# Altium project RFC_MB.PrjPcb (part 5 of 7)

## Sheet DCP_DC_DC.SchDoc
size 209 x 297 mm; Address1: Address1; Address2: Address2; Address3: Address3; Address4: Address4; SheetNumber: 1; Scale: 1:1; Разраб.: Иванов; Обозначение документа: АБВГ.123456.001 Э3; Пров.: Петров; Утв.: Сидоров; Наименование организации: ОАО "Концерн "МПО-Гидроприбор"; Перв. применение: АБВГ.123456.000; Наименование изделия 1: Плата; Наименование изделия 2: Схема электрическая; Наименование изделия 3: принципиальная; Нач. отд.: Нач. отд.; Фамилия нач. отд.: Сидоров
Used 7 times, as channels RF/RF_H/H_DCDC/DCP_H-, RF/RF_i/i_DCDC/DCP_i-, RF/RF_i/i_DCDC/DCP_i+, RF/RF_D/D_DCDC/DCP_D+, RF/RF_D/D_DCDC/DCP_D-, RF/RF_S/S_DCDC/DCP_S+, RF/RF_S/S_DCDC/DCP_S-. Parts and nets are listed once, with the designators drawn on the sheet.
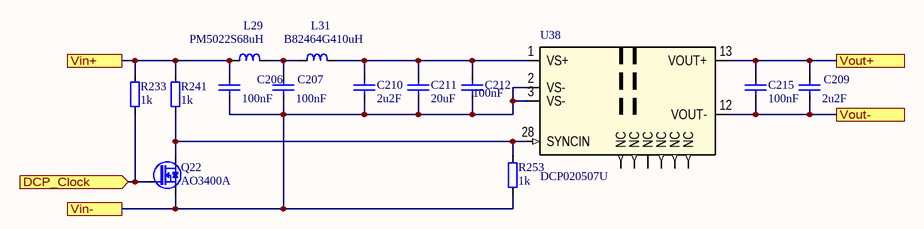
[diagram p15: DCP_DC_DC.SchDoc]

### Parts
C206  100nF  [SMD0805CAP]
C207  100nF  [SMD0805CAP]
C209  2u2F  [SMD0805CAP]
C210  2u2F  [SMD0805CAP]
C211  20uF  [CAPC1206]
C212  100nF  [SMD0805CAP]
C215  100nF  [SMD0805CAP]
L29  PM5022S68uH  [IND_Bourns_PM5022S]
L31  B82464G410uH  [IND_COILCRAFT_MSS1038]
Q22  AO3400A  [SOT95P229X119-3N]
R233  1k  [SMD0805RES]
R241  1k  [SMD0805RES]
R253  1k  [SMD0805RES]
U38  DCP020507U  [SOIC127P1033X265-12_28N]

### Ports
DCP_Clock (in), Vin+, Vin-, Vout+, Vout-

### Nets
DCP_Clock: Q22.1(G) R233.2 ; port DCP_Clock
Vin+: C206.2 L29.1 R233.1 R241.1 ; port Vin+
Vin-: C206.1 C207.1 C210.1 C211.1 C212.1 Q22.2(S) R253.2 U38.2(VS-) U38.3(VS-) ; port Vin-
Vout+: C209.2 C215.2 U38.13(VOUT+) ; port Vout+
Vout-: C209.1 C215.1 U38.12(VOUT-) ; port Vout-
NetC207_2: C207.2 L29.2 L31.1
NetC210_2: C210.2 C211.2 C212.2 L31.2 U38.1(VS+)
NetQ22_3: Q22.3(D) R241.2 R253.1 U38.28(SYNCIN)

Not connected (* = marked no-connect by the designer): U38 14(NC) 15(NC) 16(NC) 17(NC) 26(NC) 27(NC)

### Channels
RF/RF_H/H_DCDC/DCP_H-: designators end in _1; ports DCP_Clock=Clock_hDCP- Vin+=+5V Vin-=GND Vout+=GND Vout-=-7H
RF/RF_i/i_DCDC/DCP_i-: designators end in _2; ports DCP_Clock=Clock_iDCP- Vin+=+5V Vin-=GND Vout+=intG Vout-=-7i
RF/RF_i/i_DCDC/DCP_i+: designators end in _3; ports DCP_Clock=Clock_iDCP+ Vin+=+5V Vin-=GND Vout+=intG Vout-=+7H
RF/RF_D/D_DCDC/DCP_D+: designators end in _4; ports DCP_Clock=NetQ22_4_1 Vin+=+5V Vin-=GND Vout+=+7D Vout-=GND
RF/RF_D/D_DCDC/DCP_D-: designators end in _5; ports DCP_Clock=NetQ22_4_1 Vin+=+5V Vin-=GND Vout+=GND Vout-=-7D
RF/RF_S/S_DCDC/DCP_S+: designators end in _6; ports DCP_Clock=NetQ22_6_1 Vin+=+5V Vin-=GND Vout+=+7_ Vout-=GND
RF/RF_S/S_DCDC/DCP_S-: designators end in _7; ports DCP_Clock=NetQ22_6_1 Vin+=+5V Vin-=GND Vout+=GND Vout-=-7_

### Notes on the sheet
- Перв. примен.
- Справ. №
- Подп. и дата
- Инв. № дубл.
- Взам. инв. №
- Инв. № подл.
- Изм.
- Лист
- № докум.
- Подп.
- Дата
- Копировал
- Формат А4

### Library data of the parts
C206 C207 C209 C210 C212 C215 = C0805: Чип конденсатор 0805; Voltage: 25V; Vendor: Vishay; DielectricType: X5R; SMD Solders: 2; Solder Option: RM; Tolerance: 20%; Pkg: SMD0805; Device: Cap0805; Price: 2
  C206 C207 C212 C215: Value: 100nF
  C209 C210: Value: 2u2F
C211 = C1206: Чип конденсатор 0805; Voltage: 16V; Vendor: Vishay; DielectricType: X5R; SMD Solders: 2; Solder Option: RM; Tolerance: 1%; Pkg: SMD1206; Device: Cap1206; Value: 20uF; Price: 2
L29 = IND_BOURNS_PM5022S: SMD Дроссель; Vendor: Panasonic; Value: 68uH; Voltage: 2; Solder Option: RM; Tolerance: 20%; Pkg: SMD13x13mm; THD Solders: 0; Name to order: PM5022s-680M-RM; Current: 1A6; Price: 400; SMD Solders: 2; Device: PM5022S
L31 = B82464G4: SMD Дроссель; Vendor: Epcos; Value: 10uH; Voltage: 2; Solder Option: RM; Tolerance: 20%; Pkg: SMD10.4x10.4mm; THD Solders: 0; Name to order: B82464G4103M; Current: 3A5; Price: 400; SMD Solders: 2; Device: B82464G4
Q22 = AO3400A: NMOS; Vendor: UMW; Pkg: SOT23; SMD Solders: 3; Solder Option: RM; Voltage: 30V; Price: 10; Device: AO3400A; Name to order: AO3400A
R233 R241 R253 = R0805: Чип резистор 0805; Vendor: Vishay; SMD Solders: 2; Solder Option: RM; TC: 100ppm/C; Tolerance: 1%; Pkg: SMD0805; Pwr: 125mW; Device: Res0805; Price: 2; Value: 1k
U38 = DCP02xxyyU: DC/DC xxV to isolated  yyV; Vendor: Texas Instruments; Value: 0507U; Device: DCP02; Pkg: SOIC28; SMD Solders: 6; Solder Option: RM; Voltage: 7V; Copyright: Copyright (C) 2022 Ultra Librarian. All rights reserved.; Price: 1000

## Sheet Integrator.SchDoc
size 594 x 420 mm; Address1: Address1; Address2: Address2; Address3: Address3; Address4: Address4; SheetNumber: 1; Scale: 1:1; Разраб.: Иванов; Обозначение документа: АБВГ.123456.001 Э3; Пров.: Петров; Утв.: Сидоров; Наименование организации: ОАО "Концерн "МПО-Гидроприбор"; Перв. применение: АБВГ.123456.000; Наименование изделия 1: Плата; Наименование изделия 2: Схема электрическая; Наименование изделия 3: принципиальная; Нач. отд.: Нач. отд.; Фамилия нач. отд.: Сидоров
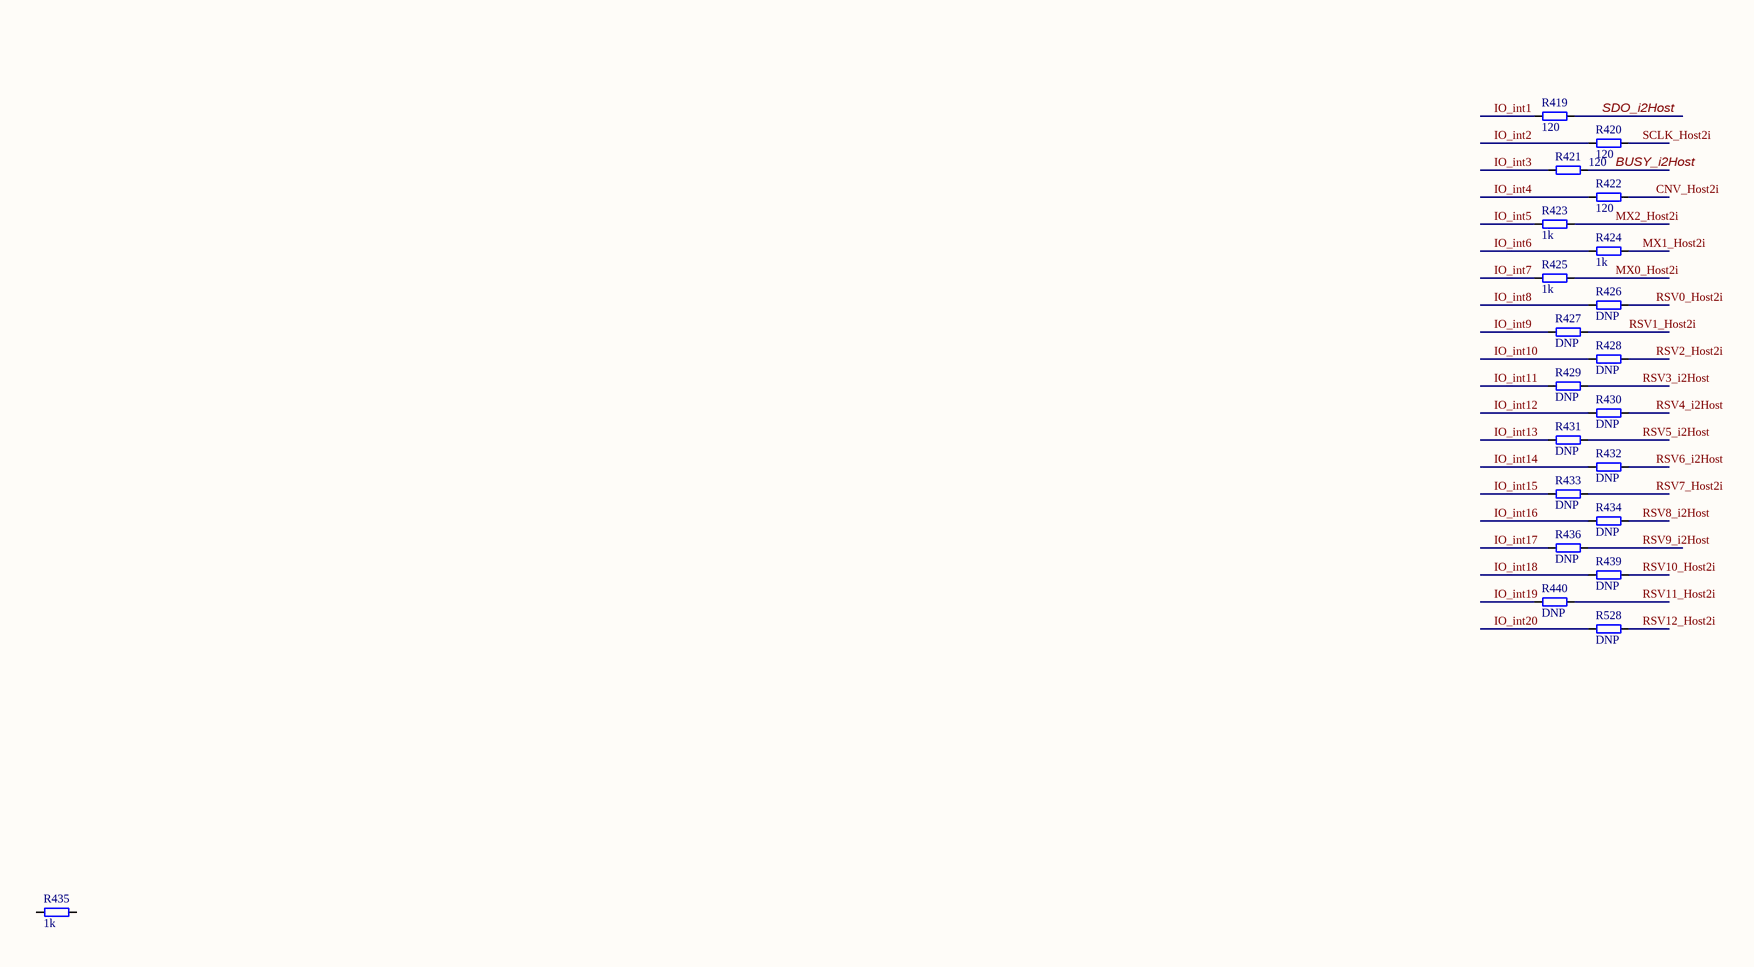
[diagram p16: Integrator.SchDoc, left]
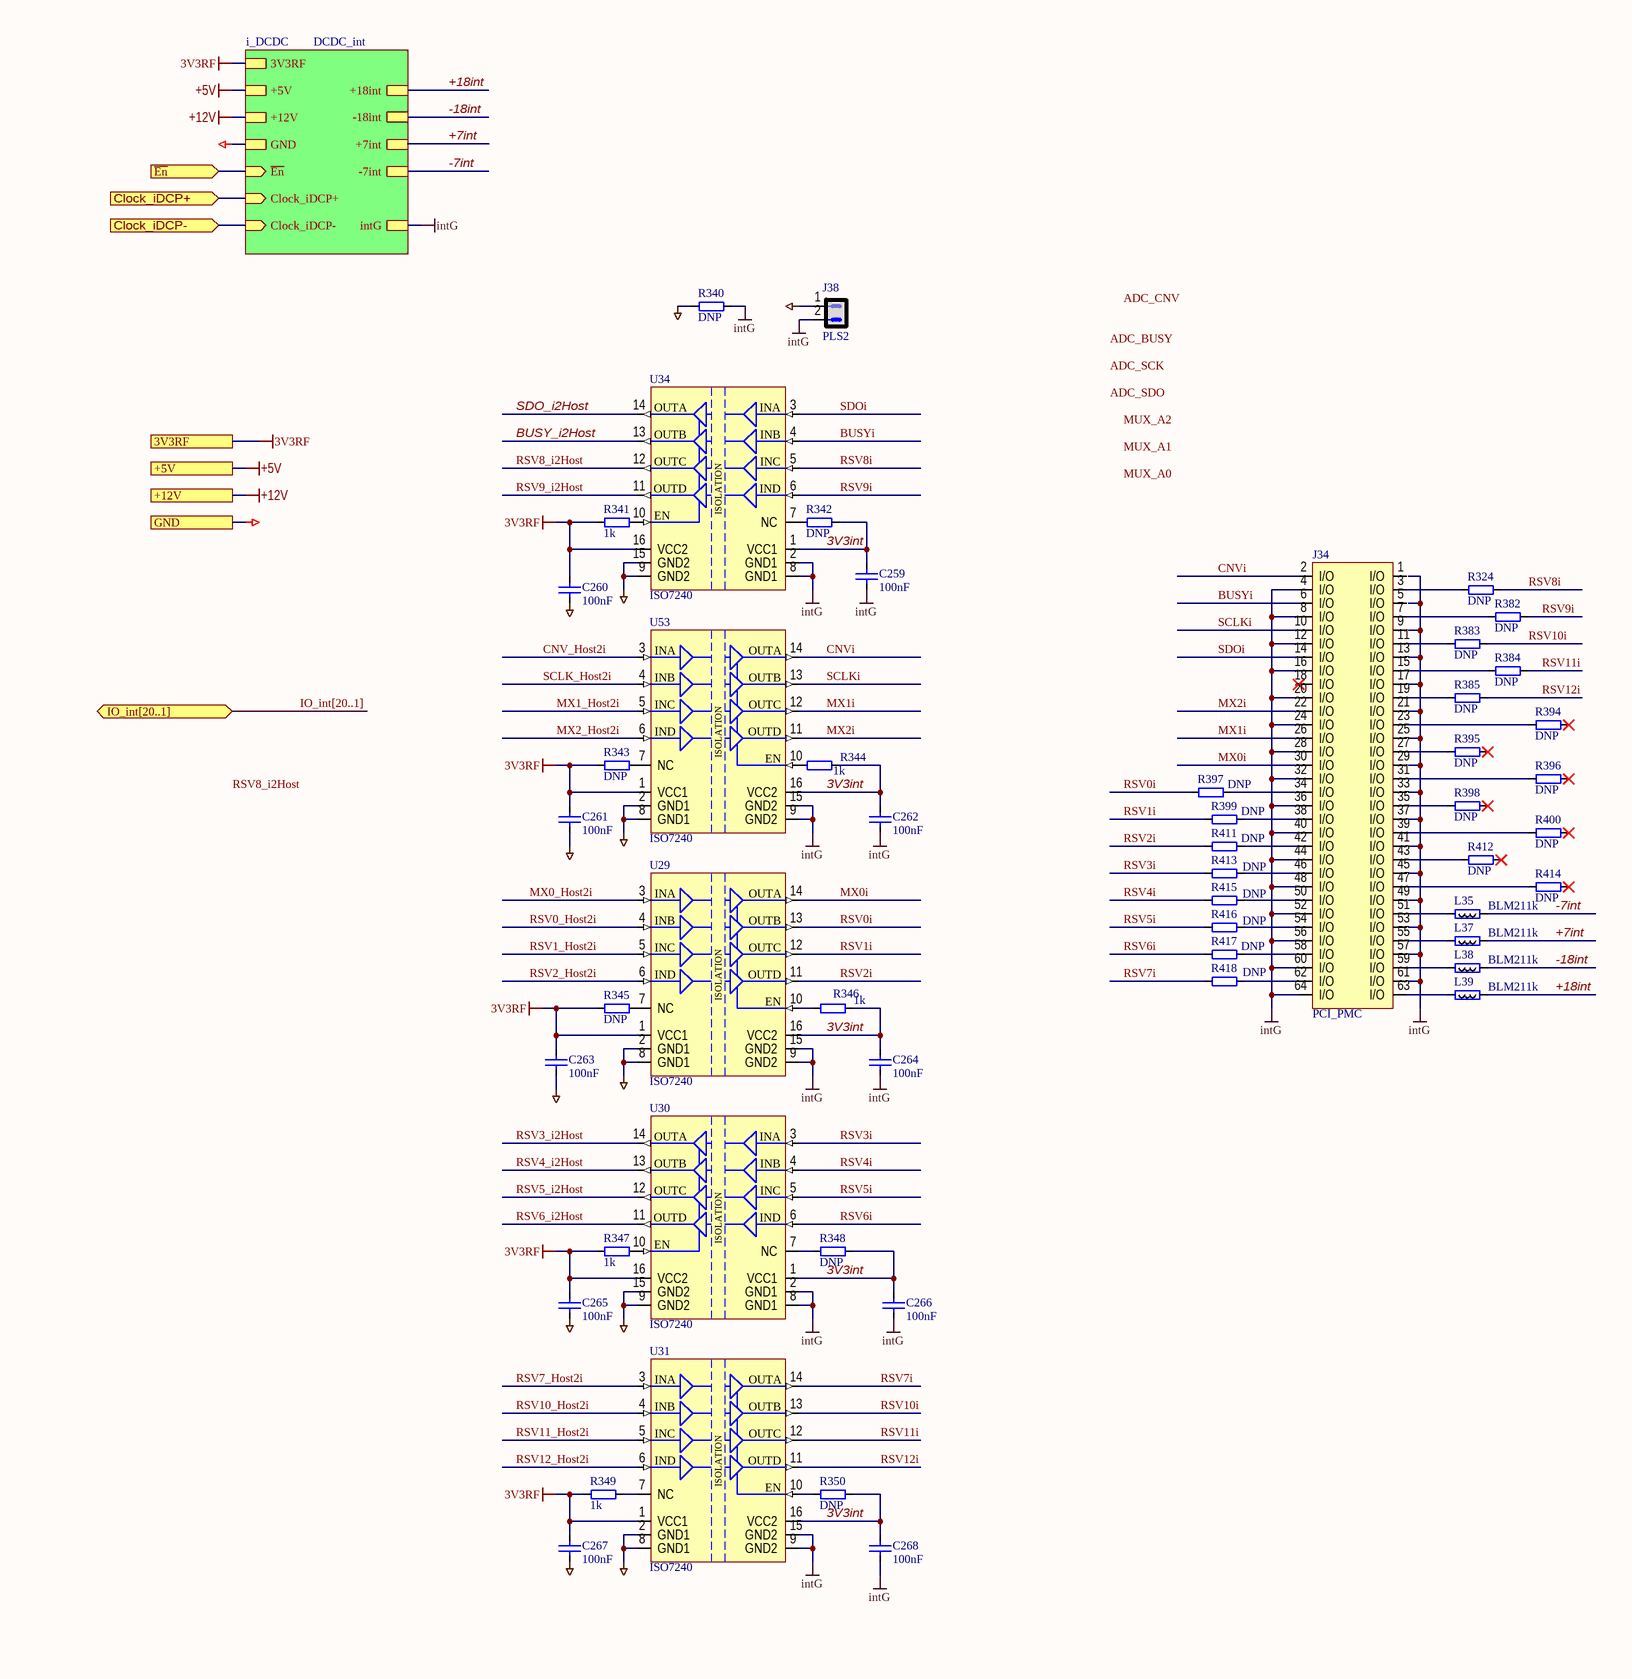
[diagram p17: Integrator.SchDoc, right]

### Parts
C259  100nF  [SMD0805CAP]
C260  100nF  [SMD0805CAP]
C261  100nF  [SMD0805CAP]
C262  100nF  [SMD0805CAP]
C263  100nF  [SMD0805CAP]
C264  100nF  [SMD0805CAP]
C265  100nF  [SMD0805CAP]
C266  100nF  [SMD0805CAP]
C267  100nF  [SMD0805CAP]
C268  100nF  [SMD0805CAP]
J34  PCI_PMC  [TYCO_120521-1]
J38  PLS2  [PLS2]
L35  BLM211k  [RESC2012X50N]
L37  BLM211k  [RESC2012X50N]
L38  BLM211k  [RESC2012X50N]
L39  BLM211k  [RESC2012X50N]
R324  DNP  [SMD0805RES]
R340  DNP  [SMD0805RES]
R341  1k  [SMD0805RES]
R342  DNP  [SMD0805RES]
R343  DNP  [SMD0805RES]
R344  1k  [SMD0805RES]
R345  DNP  [SMD0805RES]
R346  1k  [SMD0805RES]
R347  1k  [SMD0805RES]
R348  DNP  [SMD0805RES]
R349  1k  [SMD0805RES]
R350  DNP  [SMD0805RES]
R382  DNP  [SMD0805RES]
R383  DNP  [SMD0805RES]
R384  DNP  [SMD0805RES]
R385  DNP  [SMD0805RES]
R394  DNP  [SMD0805RES]
R395  DNP  [SMD0805RES]
R396  DNP  [SMD0805RES]
R397  DNP  [SMD0805RES]
R398  DNP  [SMD0805RES]
R399  DNP  [SMD0805RES]
R400  DNP  [SMD0805RES]
R411  DNP  [SMD0805RES]
R412  DNP  [SMD0805RES]
R413  DNP  [SMD0805RES]
R414  DNP  [SMD0805RES]
R415  DNP  [SMD0805RES]
R416  DNP  [SMD0805RES]
R417  DNP  [SMD0805RES]
R418  DNP  [SMD0805RES]
R419  120  [SMD0805RES]
R420  120  [SMD0805RES]
R421  120  [SMD0805RES]
R422  120  [SMD0805RES]
R423  1k  [SMD0805RES]
R424  1k  [SMD0805RES]
R425  1k  [SMD0805RES]
R426  DNP  [SMD0805RES]
R427  DNP  [SMD0805RES]
R428  DNP  [SMD0805RES]
R429  DNP  [SMD0805RES]
R430  DNP  [SMD0805RES]
R431  DNP  [SMD0805RES]
R432  DNP  [SMD0805RES]
R433  DNP  [SMD0805RES]
R434  DNP  [SMD0805RES]
R435  1k  [SMD0805RES]
R436  DNP  [SMD0805RES]
R439  DNP  [SMD0805RES]
R440  DNP  [SMD0805RES]
R528  DNP  [SMD0805RES]
U29  ISO7240  [SOIC127P1030X265-16N]
U30  ISO7240  [SOIC127P1030X265-16N]
U31  ISO7240  [SOIC127P1030X265-16N]
U34  ISO7240  [SOIC127P1030X265-16N]
U53  ISO7240  [SOIC127P1030X265-16N]

### Sub-sheets
i_DCDC = DCDC_int: +18int, -18int, -7int, +7int, ~{En} (in), Clock_iDCP- (in), Clock_iDCP+ (in), +5V, +12V, GND, 3V3RF, intG

### Ports
3V3RF, +5V, +12V, Clock_iDCP+ (in), Clock_iDCP- (in), GND, IO_int[20..1] (bidir), ~{En} (in)

### Nets
3V3RF: C260.2 C261.2 C263.2 C265.2 C267.2 R341.1 R343.1 R345.1 R347.1 R349.1 U29.1(VCC1) U30.16(VCC2) U31.1(VCC1) U34.16(VCC2) U53.1(VCC1) ; port 3V3RF, sheet i_DCDC/3V3RF
+5V: port +5V, sheet i_DCDC/+5V
+12V: port +12V, sheet i_DCDC/+12V
GND: C260.1 C261.1 C263.1 C265.1 C267.1 J38.1 R340.1 U29.2(GND1) U29.8(GND1) U30.9(GND2) U30.15(GND2) U31.2(GND1) U31.8(GND1) U34.9(GND2) U34.15(GND2) U53.2(GND1) U53.8(GND1) ; port GND, sheet i_DCDC/GND
intG: C259.1 C262.1 C264.1 C266.1 C268.1 J34.4(I/O) J34.8(I/O) J34.12(I/O) J34.16(I/O) J34.20(I/O) J34.24(I/O) J34.28(I/O) J34.32(I/O) J34.36(I/O) J34.40(I/O) J34.44(I/O) J34.48(I/O) J34.52(I/O) J34.56(I/O) J34.60(I/O) J34.64(I/O) J38.2 R340.2 U29.9(GND2) U29.15(GND2) U30.2(GND1) U30.8(GND1) U31.9(GND2) U31.15(GND2) U34.2(GND1) U34.8(GND1) U53.9(GND2) U53.15(GND2) ; sheet i_DCDC/intG
3V3int: C259.2 C262.2 C264.2 C266.2 C268.2 R342.2 R344.2 R346.2 R348.2 R350.2 U29.16(VCC2) U30.1(VCC1) U31.16(VCC2) U34.1(VCC1) U53.16(VCC2)
+7int: L37.2 ; sheet i_DCDC/+7int
+18int: L39.2 ; sheet i_DCDC/+18int
-7int: L35.2 ; sheet i_DCDC/-7int
-18int: L38.2 ; sheet i_DCDC/-18int
~{En}: port ~{En}, sheet i_DCDC/~{En}
BUSY_i2Host: R421.2 U34.13(OUTB)
BUSYi: J34.6(I/O) U34.4(INB)
Clock_iDCP+: port Clock_iDCP+, sheet i_DCDC/Clock_iDCP+
Clock_iDCP-: port Clock_iDCP-, sheet i_DCDC/Clock_iDCP-
CNV_Host2i: R422.2 U53.3(INA)
CNVi: J34.2(I/O) U53.14(OUTA)
IO_int1: R419.1  [project net IO_BL17]
IO_int2: R420.1  [project net IO_BL18]
IO_int3: R421.1  [project net IO_BL19]
IO_int4: R422.1  [project net IO_BL20]
IO_int5: R423.1  [project net IO_BL21]
IO_int6: R424.1  [project net IO_BL22]
IO_int7: R425.1  [project net IO_BL23]
IO_int8: R426.1  [project net IO_BL24]
IO_int9: R427.1  [project net IO_BL25]
IO_int10: R428.1  [project net IO_BL26]
IO_int11: R429.1  [project net IO_BL27]
IO_int12: R430.1  [project net IO_BL28]
IO_int13: R431.1  [project net IO_BL29]
IO_int14: R432.1  [project net IO_BL30]
IO_int15: R433.1  [project net IO_BL31]
IO_int16: R434.1  [project net IO_BL32]
IO_int17: R436.1  [project net IO_BL33]
IO_int18: R439.1  [project net IO_BL34]
IO_int19: R440.1  [project net IO_BL35]
IO_int20: R528.1  [project net IO_BL36]
MX0_Host2i: R425.2 U29.3(INA)
MX0i: J34.30(I/O) U29.14(OUTA)
MX1_Host2i: R424.2 U53.5(INC)
MX1i: J34.26(I/O) U53.12(OUTC)
MX2_Host2i: R423.2 U53.6(IND)
MX2i: J34.22(I/O) U53.11(OUTD)
RSV0_Host2i: R426.2 U29.4(INB)
RSV0i: R397.1 U29.13(OUTB)
RSV1_Host2i: R427.2 U29.5(INC)
RSV1i: R399.1 U29.12(OUTC)
RSV2_Host2i: R428.2 U29.6(IND)
RSV2i: R411.1 U29.11(OUTD)
RSV3_i2Host: R429.2 U30.14(OUTA)
RSV3i: R413.1 U30.3(INA)
RSV4_i2Host: R430.2 U30.13(OUTB)
RSV4i: R415.1 U30.4(INB)
RSV5_i2Host: R431.2 U30.12(OUTC)
RSV5i: R416.1 U30.5(INC)
RSV6_i2Host: R432.2 U30.11(OUTD)
RSV6i: R417.1 U30.6(IND)
RSV7_Host2i: R433.2 U31.3(INA)
RSV7i: R418.1 U31.14(OUTA)
RSV8_i2Host: R434.2 U34.12(OUTC)
RSV8i: R324.2 U34.5(INC)
RSV9_i2Host: R436.2 U34.11(OUTD)
RSV9i: R382.2 U34.6(IND)
RSV10_Host2i: R439.2 U31.4(INB)
RSV10i: R383.2 U31.13(OUTB)
RSV11_Host2i: R440.2 U31.5(INC)
RSV11i: R384.2 U31.12(OUTC)
RSV12_Host2i: R528.2 U31.6(IND)
RSV12i: R385.2 U31.11(OUTD)
SCLK_Host2i: R420.2 U53.4(INB)
SCLKi: J34.10(I/O) U53.13(OUTB)
SDO_i2Host: R419.2 U34.14(OUTA)
SDOi: J34.14(I/O) U34.3(INA)
NetJ34_3: J34.3(I/O) R324.1
NetJ34_7: J34.7(I/O) R382.1
NetJ34_11: J34.11(I/O) R383.1
NetJ34_15: J34.15(I/O) R384.1
NetJ34_19: J34.19(I/O) R385.1
NetJ34_23: J34.23(I/O) R394.1
NetJ34_27: J34.27(I/O) R395.1
NetJ34_31: J34.31(I/O) R396.1
NetJ34_34: J34.34(I/O) R397.2
NetJ34_35: J34.35(I/O) R398.1
NetJ34_38: J34.38(I/O) R399.2
NetJ34_39: J34.39(I/O) R400.1
NetJ34_42: J34.42(I/O) R411.2
NetJ34_43: J34.43(I/O) R412.1
NetJ34_46: J34.46(I/O) R413.2
NetJ34_47: J34.47(I/O) R414.1
NetJ34_50: J34.50(I/O) R415.2
NetJ34_51: J34.51(I/O) L35.1
NetJ34_54: J34.54(I/O) R416.2
NetJ34_55: J34.55(I/O) L37.1
NetJ34_58: J34.58(I/O) R417.2
NetJ34_59: J34.59(I/O) L38.1
NetJ34_62: J34.62(I/O) R418.2
NetJ34_63: J34.63(I/O) L39.1
NetR341_2: R341.2 U34.10(EN)
NetR342_1: R342.1 U34.7(NC)
NetR343_2: R343.2 U53.7(NC)
NetR344_1: R344.1 U53.10(EN)
NetR345_2: R345.2 U29.7(NC)
NetR346_1: R346.1 U29.10(EN)
NetR347_2: R347.2 U30.10(EN)
NetR348_1: R348.1 U30.7(NC)
NetR349_2: R349.2 U31.7(NC)
NetR350_1: R350.1 U31.10(EN)

Not connected (* = marked no-connect by the designer): J34 1(I/O) 5(I/O) 9(I/O) 13(I/O) 17(I/O) 18(I/O)* 21(I/O) 25(I/O) 29(I/O) 33(I/O) 37(I/O) 41(I/O) 45(I/O) 49(I/O) 53(I/O) 57(I/O) 61(I/O); R394 2*; R395 2*; R396 2*; R398 2*; R400 2*; R412 2*; R414 2*; R435 1 2

### Buses and harness runs
bus IO_int[20..1] = port IO_int[20..1]

### Notes on the sheet
- Labels drawn without touching a wire or pin: ADC_BUSY, ADC_CNV, ADC_SCK, ADC_SDO, MUX_A0, MUX_A1, MUX_A2, RSV8_i2Host
- Подп. и дата
- Инв. № дубл.
- Взам. инв. №
- Инв. № подл.
- Изм.
- Лист
- № докум.
- Подп.
- Дата
- Копировал
- Формат А2
- (in symbol ISO7240M) ISOLATION

### Library data of the parts
C259-C268 = C0805: as C206 on sheet DCP_DC_DC; Value: 100nF; Price: 2
J34 = PCI_PMC_M: PCI Mezzanine Connector; IEEE 1386 MainBoard; Manufactuer: TE Connectivity; PartField: 120527-1; SolderOption: 2; Pkg: PMC Male (IEEE 1386); Value: PCI_PMC; Vendor: TE Connectivity
J38 = PLS2: Vendor: Confly; SMD Solders: 0; Solder Option: RM; THD Solders: 2; Price: 1; Device: PLS2
L35 L37-L39 = BLM21: SMD Ferrite bead 0805; Vendor: Vishay; Value: 1k; Pkg: SMD0805; SMD Solders: 2; Solder Option: RM; Price: 10; Device: BLM21
R324 R341 R344 R346 R347 R349 R382-R385 R394-R400 R411-R436 R439 R440 R528 = R0805: as R233 on sheet DCP_DC_DC; Price: 2
  R324 R382-R385 R394-R400 R411-R418 R426-R434 R436 R439 R440 R528: Value: DNP
  R341 R344 R346 R347 R349 R423-R425 R435: Value: 1k
  R419-R422: Value: 120
R340 R342 R343 R345 R348 R350 = R0805: Чип резистор 0805; Vendor: Vishay; SMD Solders: 2; Solder Option: i; TC: 100ppm/C; Tolerance: 1%; Pkg: SMD0805; Pwr: 125mW; Device: Res0805; Price: 2; Value: DNP
U29-U31 U34 U53 = ISO7240M: Двунаправленный буфер; Pkg: SOIC16DW; SMD Solders: 16; Solder Option: RM; THD Solders: 0; Vendor: Texas Instruments; Voltage: 3V3 or 5V; Name to order: ISO7240MDWR; Current: 30; Device: ISO7240; Price: 3500

## Sheet DCDC_int.SchDoc
size 420 x 297 mm; Address1: Address1; Address2: Address2; Address3: Address3; Address4: Address4; SheetNumber: 1; Scale: 1:1; Разраб.: Иванов; Обозначение документа: АБВГ.123456.001 Э3; Пров.: Петров; Утв.: Сидоров; Наименование организации: ОАО "Концерн "МПО-Гидроприбор"; Перв. применение: АБВГ.123456.000; Наименование изделия 1: Плата; Наименование изделия 2: Схема электрическая; Наименование изделия 3: принципиальная; Нач. отд.: Нач. отд.; Фамилия нач. отд.: Сидоров
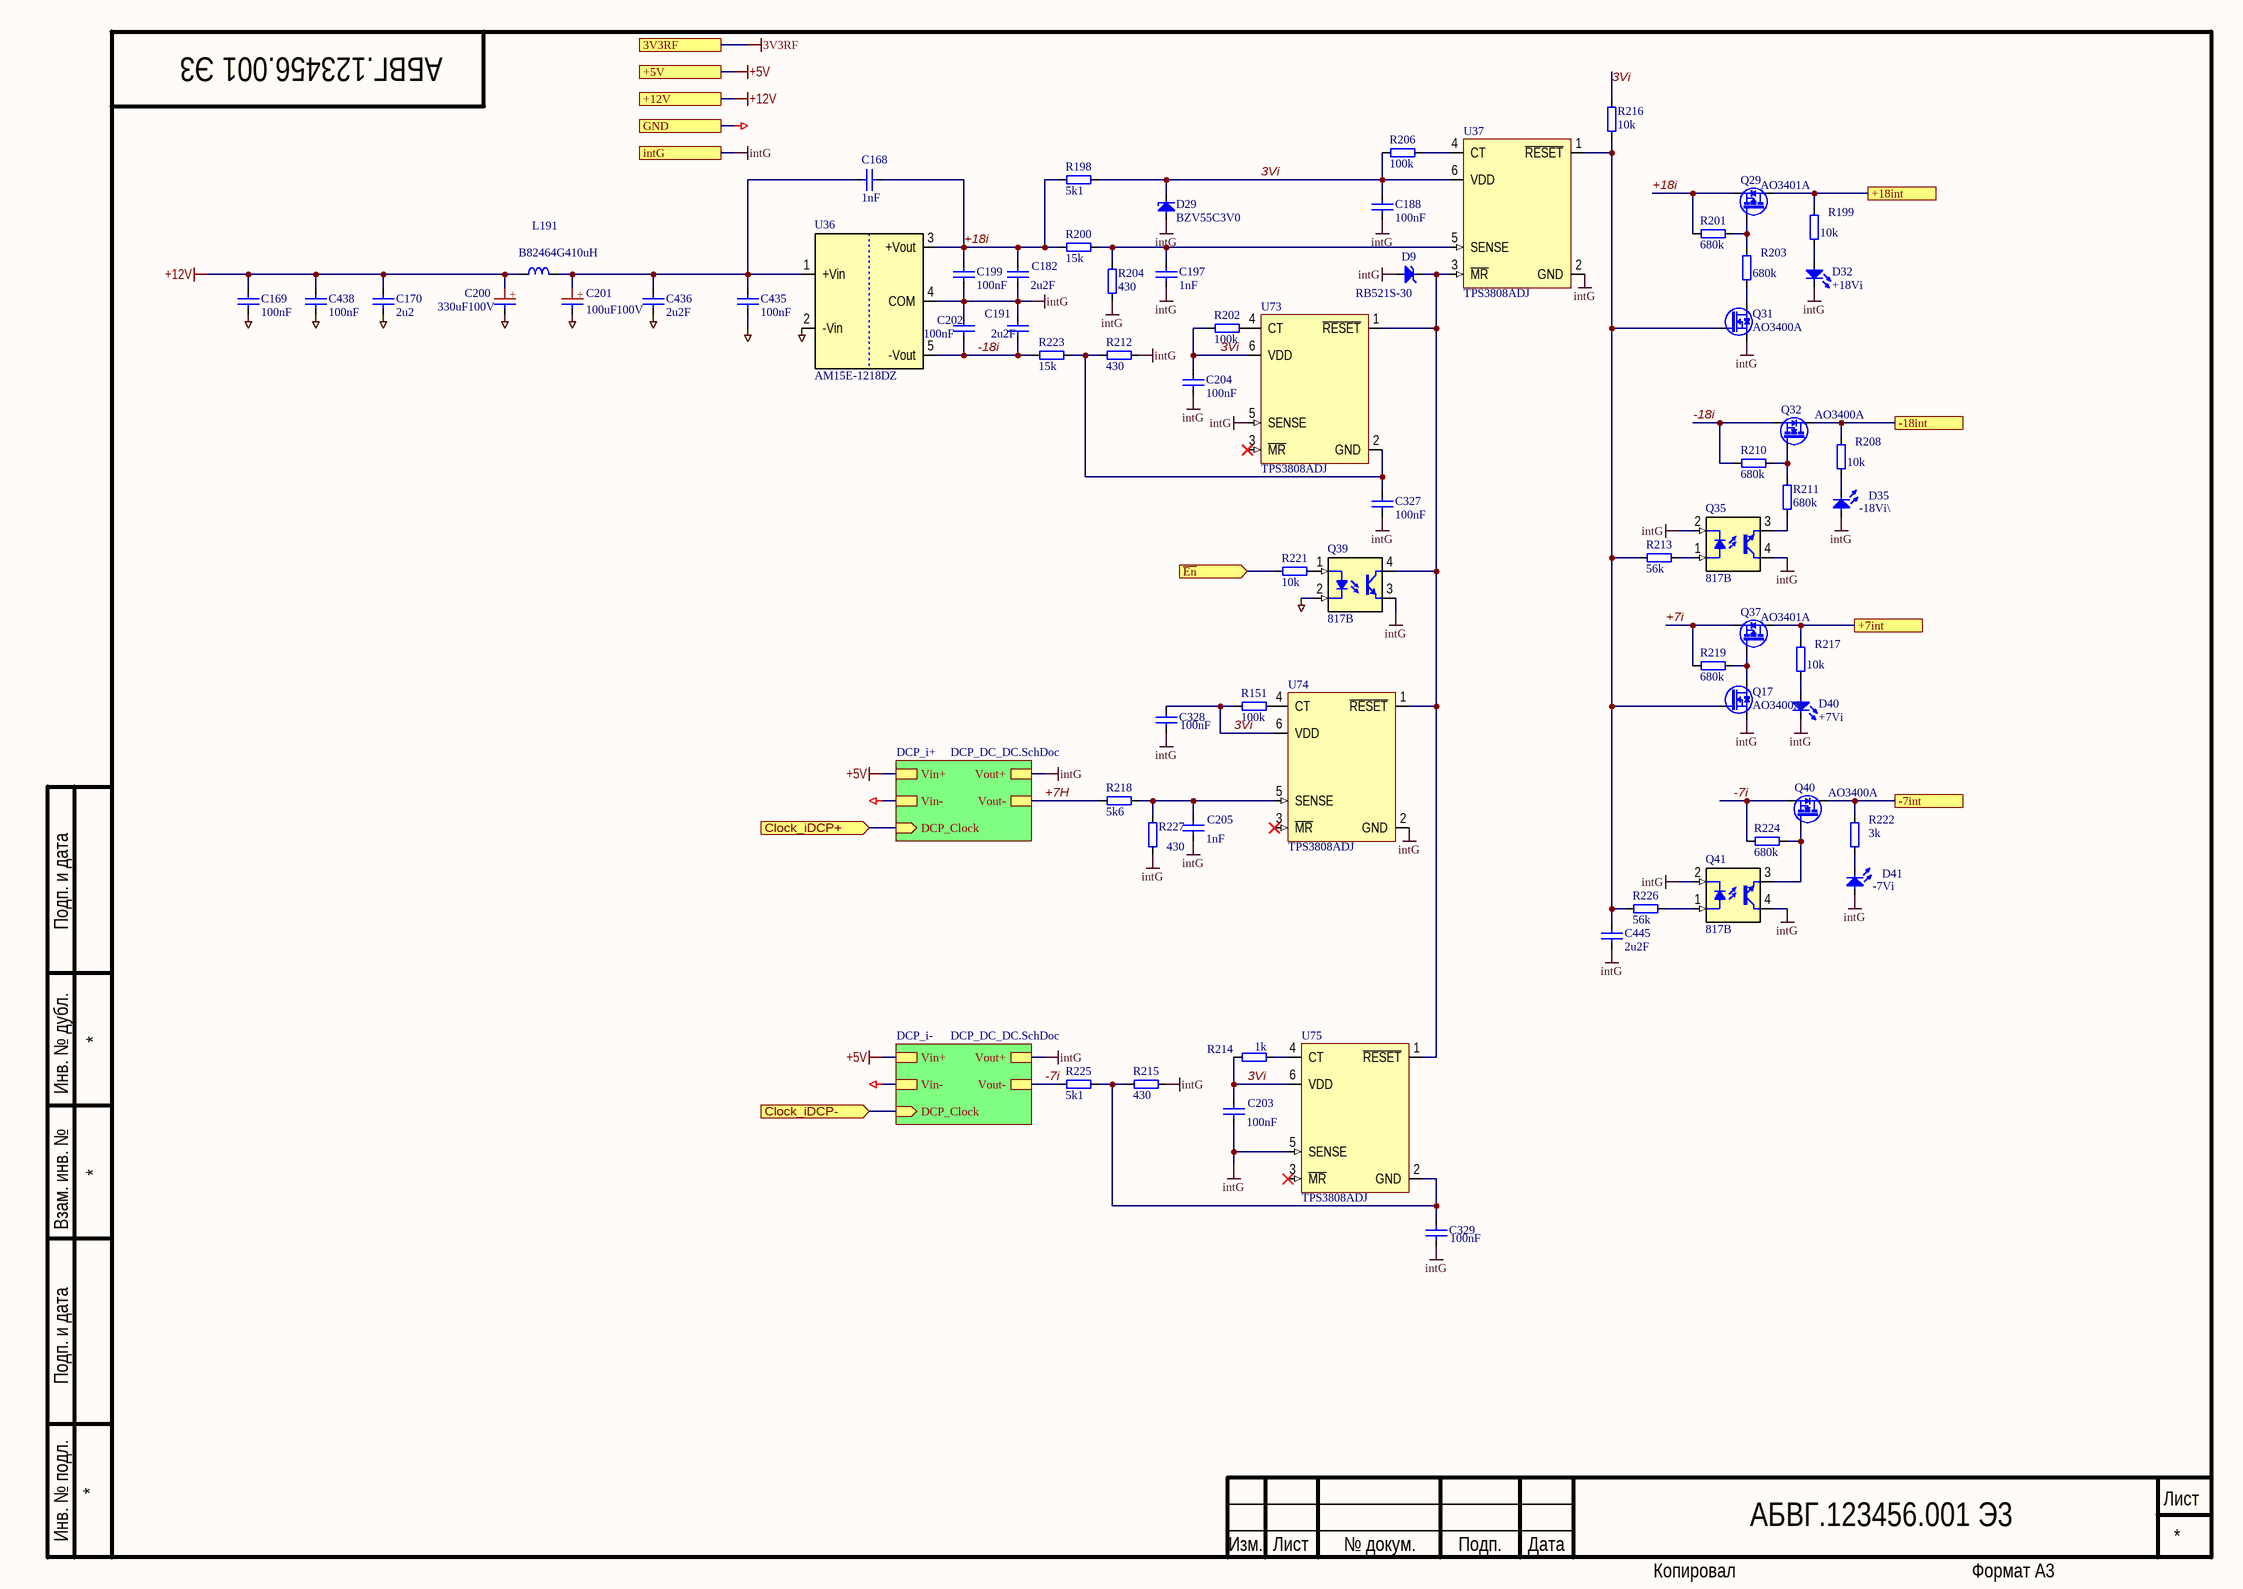
[diagram p18: DCDC_int.SchDoc]

### Parts
C168  1nF  [SMD0805CAP]
C169  100nF  [SMD0805CAP]
C170  2u2  [SMD0805CAP]
C182  2u2F  [SMD0805CAP]
C188  100nF  [SMD0805CAP]
C191  2u2F  [SMD0805CAP]
C197  1nF  [SMD0805CAP]
C199  100nF  [SMD0805CAP]
C200  330uF100V  [CAPPR750-1600X2000]
C201  100uF100V  [CAPPR500-1000X1250]
C202  100nF  [SMD0805CAP]
C203  100nF  [SMD0805CAP]
C204  100nF  [SMD0805CAP]
C205  1nF  [SMD0805CAP]
C327  100nF  [SMD0805CAP]
C328  100nF  [SMD0805CAP]
C329  100nF  [SMD0805CAP]
C435  100nF  [SMD0805CAP]
C436  2u2F  [SMD0805CAP]
C438  100nF  [SMD0805CAP]
C445  2u2F  [SMD0805CAP]
D9  RB521S-30  [SODFL1608X65N]
D29  BZV55C3V0  [DIOMELF3516N]
D32  +18Vi  [LED0603]
D35  -18Vi\  [LED0603]
D40  +7Vi  [LED0603]
D41  -7Vi  [LED0603]
L191  B82464G410uH  [IND_COILCRAFT_MSS1038]
Q17  AO3400A  [SOT95P229X119-3N]
Q29  AO3401A  [SOT95P229X119-3N]
Q31  AO3400A  [SOT95P229X119-3N]
Q32  AO3400A  [SOT95P229X119-3N]
Q35  817B  [DIP4-300]
Q37  AO3401A  [SOT95P229X119-3N]
Q39  817B  [DIP4-300]
Q40  AO3400A  [SOT95P229X119-3N]
Q41  817B  [DIP4-300]
R151  100k  [SMD0805RES]
R198  5k1  [SMD0805RES]
R199  10k  [SMD0805RES]
R200  15k  [SMD0805RES]
R201  680k  [SMD0805RES]
R202  100k  [SMD0805RES]
R203  680k  [SMD0805RES]
R204  430  [SMD0805RES]
R206  100k  [SMD0805RES]
R208  10k  [SMD0805RES]
R210  680k  [SMD0805RES]
R211  680k  [SMD0805RES]
R212  430  [SMD0805RES]
R213  56k  [SMD0805RES]
R214  1k  [SMD0805RES]
R215  430  [SMD0805RES]
R216  10k  [SMD0805RES]
R217  10k  [SMD0805RES]
R218  5k6  [SMD0805RES]
R219  680k  [SMD0805RES]
R221  10k  [SMD0805RES]
R222  3k  [SMD0805RES]
R223  15k  [SMD0805RES]
R224  680k  [SMD0805RES]
R225  5k1  [SMD0805RES]
R226  56k  [SMD0805RES]
R227  430  [SMD0805RES]
U36  AM15E-1218DZ  [AM15E]
U37  TPS3808ADJ  [SOT95P270X145-6N]
U73  TPS3808ADJ  [SOT95P270X145-6N]
U74  TPS3808ADJ  [SOT95P270X145-6N]
U75  TPS3808ADJ  [SOT95P270X145-6N]

### Sub-sheets
DCP_i+ = DCP_DC_DC.SchDoc: DCP_Clock (in), Vout+, Vout-, Vin-, Vin+
DCP_i- = DCP_DC_DC.SchDoc: DCP_Clock (in), Vout+, Vout-, Vin-, Vin+

### Ports
3V3RF, +5V, +7int, +12V, +18int, -7int, -18int, Clock_iDCP+ (in), Clock_iDCP- (in), GND, intG, ~{En} (in)

### Nets
+5V: port +5V, sheet DCP_i-/Vin+, sheet DCP_i+/Vin+
+12V: C169.2 C170.2 C200.1(+) C438.2 L191.1 ; port +12V
GND: C169.1 C170.1 C200.2 C201.2 C435.1 C436.1 C438.1 Q39.2(C) U36.2(-Vin) ; port GND, sheet DCP_i-/Vin-, sheet DCP_i+/Vin-
intG: C182.1 C188.1 C191.2 C197.1 C199.2 C202.1 C203.1 C204.2 C205.1 C327.2 C328.1 C329.1 C445.2 D9.2(A) D29.2(A) D32.1(C) D35.2(A) D40.1(C) D41.2(A) Q17.2(S) Q31.2(S) Q35.2(C) Q35.4(C) Q39.3(E) Q41.2(C) Q41.4(C) R204.2 R212.2 R215.2 R227.2 U36.4(COM) U37.2(GND) U73.5(SENSE) U74.2(GND) U75.5(SENSE) ; port intG, sheet DCP_i-/Vout+, sheet DCP_i+/Vout+
3Vi: C188.2 C203.2 C204.1 C328.2 D29.1(C) R151.1 R198.1 R202.1 R206.1 R214.1 R216.1 U37.6(VDD) U73.6(VDD) U74.6(VDD) U75.6(VDD)
+7H: R218.2 ; sheet DCP_i+/Vout-
+7i: Q37.2(S) R219.2
+7int: Q37.3(D) R217.2 ; port +7int
+18i: C168.2 C182.2 C199.1 Q29.2(S) R198.2 R200.2 R201.2 U36.3(+Vout)
+18int: Q29.3(D) R199.2 ; port +18int
-7i: Q40.2(S) R224.2 R225.2 ; sheet DCP_i-/Vout-
-7int: Q40.3(D) R222.2 ; port -7int
-18i: C191.1 C202.2 Q32.2(S) R210.2 R223.1 U36.5(-Vout)
-18int: Q32.3(D) R208.2 ; port -18int
~{En}: R221.1 ; port ~{En}
Clock_iDCP+: port Clock_iDCP+, sheet DCP_i+/DCP_Clock
Clock_iDCP-: port Clock_iDCP-, sheet DCP_i-/DCP_Clock
NetC168_1: C168.1 C201.1(+) C435.2 C436.2 L191.2 U36.1(+Vin)
NetC197_2: C197.2 R200.1 R204.1 U37.5(SENSE)
NetC205_2: C205.2 R218.1 R227.1 U74.5(SENSE)
NetC327_1: C327.1 R212.1 R223.2 U73.2(GND)
NetC329_2: C329.2 R215.1 R225.1 U75.2(GND)
NetC445_1: C445.1 Q17.1(G) Q31.1(G) R213.1 R216.2 R226.1 U37.1(~{RESET})
NetD9_1: D9.1(C) Q39.4(C) U37.3(~{MR}) U73.1(~{RESET}) U74.1(~{RESET}) U75.1(~{RESET})
NetD32_2: D32.2(A) R199.1
NetD35_1: D35.1(C) R208.1
NetD40_2: D40.2(A) R217.1
NetD41_1: D41.1(C) R222.1
NetQ17_3: Q17.3(D) Q37.1(G) R219.1
NetQ29_1: Q29.1(G) R201.1 R203.2
NetQ31_3: Q31.3(D) R203.1
NetQ32_1: Q32.1(G) R210.1 R211.2
NetQ35_1: Q35.1(A) R213.2
NetQ35_3: Q35.3(E) R211.1
NetQ39_1: Q39.1(A) R221.2
NetQ40_1: Q40.1(G) Q41.3(E) R224.1
NetQ41_1: Q41.1(A) R226.2
NetR151_2: R151.2 U74.4(CT)
NetR202_2: R202.2 U73.4(CT)
NetR206_2: R206.2 U37.4(CT)
NetR214_2: R214.2 U75.4(CT)

Not connected (* = marked no-connect by the designer): U73 3(~{MR})*; U74 3(~{MR})*; U75 3(~{MR})*

### Notes on the sheet
- Подп. и дата
- Инв. № дубл.
- Взам. инв. №
- Инв. № подл.
- Изм.
- Лист
- № докум.
- Подп.
- Дата
- Копировал
- Формат А3

### Library data of the parts
C168-C170 C182 C188 C191 C197 C199 C202-C205 C327-C329 C435 C436 C438 C445 = C0805: as C206 on sheet DCP_DC_DC; Price: 2
  C168 C197 C205: Value: 1nF
  C169 C188 C199 C202-C204 C327-C329 C435 C438: Value: 100nF
  C170: Value: 2u2
  C182 C191 C436 C445: Value: 2u2F
C200 = CAP_POL_7_5x16: Конденсатор полярный d16 p7.5мм; Voltage: 100V; Vendor: Vishay; Value: 330uF; SMD Solders: 0; Solder Option: RM; Tolerance: 20%; Pkg: 7.5x16mm; Device: Cap+; THD Solders: 2; Price: 30
C201 = CAP_POL_5x10: Конденсатор полярный d10 p5мм; Voltage: 100V; Vendor: Vishay; Value: 100uF; SMD Solders: 0; Solder Option: RM; Tolerance: 20%; Pkg: 5x10mm; Device: Cap+; THD Solders: 2; Price: 20
D9 = RB521S-30: Чип Шоттки диод; Vendor: CTK; Voltage: 30V; SMD Solders: 2; Solder Option: RM; Pkg: SOD523; Price: 5; Device: RB521S-30; Name to order: RB521S-30
D29 = BZV55C: Чип cтабилитрон; Vendor: LGE; Value: 3V0; Voltage: 3V; SMD Solders: 2; Solder Option: RM; Pkg: SOD80; Current: 5; Price: 5; Device: BZV55C; Name to order: BZV55C3V0
D32 D35 D40 D41 = LED0603: Чип светодиод 0603; Vendor: KB; SMD Solders: 2; Solder Option: RM; Pkg: SMD0603; Price: 10; Device: LED0603
  D32: Value: +18Vi
  D35: Value: -18Vi\
  D40: Value: +7Vi
  D41: Value: -7Vi
L191 = B82464G4: as L31 on sheet DCP_DC_DC; Price: 400; SMD Solders: 2; Device: B82464G4
Q17 Q31 Q32 Q40 = AO3400A: as Q22 on sheet DCP_DC_DC; Price: 10; Device: AO3400A; Name to order: AO3400A
Q29 Q37 = AO3401A: PMOS; Vendor: UMW; Pkg: SOT23; SMD Solders: 3; Solder Option: RM; THD Solders: 0; Voltage: -30V; Price: 10; Device: AO3401A; Name to order: AO3401A
Q35 Q39 Q41 = 817B: Optotransistor; Pkg: DIP4; SMD Solders: 0; Solder Option: RM; THD Solders: 4; Vendor: UMW; Voltage: 35V; Device: 817B; Price: 10; Name to order: 817B; Current: 0
R151 R198-R204 R206 R208 R210-R219 R221-R227 = R0805: as R233 on sheet DCP_DC_DC; Price: 2
  R151 R202 R206: Value: 100k
  R198 R225: Value: 5k1
  R199 R208 R216 R217 R221: Value: 10k
  R200 R223: Value: 15k
  R201 R203 R210 R211 R219 R224: Value: 680k
  R204 R212 R215 R227: Value: 430
  R213 R226: Value: 56k
  R214: Value: 1k
  R218: Value: 5k6
  R222: Value: 3k
U36 = AM15E-: Negative LDO Linear stabilizer; Vendor: Aimtec; Value: 1218DZ; Pkg: DCDC_5; SMD Solders: 0; Solder Option: RM; THD Solders: 5; Name to order: AM15-1218DZ; Price: 2000; Device: AM15E-
U37 U73-U75 = TPS3808: Supervisory Circuit. Low-Quiescent-Current, Programmable-Delay; Vendor: Texas Instruments; Value: ADJ; Pkg: SOT23-6; SMD Solders: 6; Solder Option: RM; THD Solders: 0; Name to order: TPS3808G01DBV; Current: 6uA; thVoltage: 400mV; Price: 200; Device: TPS3808

## Sheet DDS.SchDoc
size 594 x 420 mm; Address1: Address1; Address2: Address2; Address3: Address3; Address4: Address4; SheetNumber: 1; Scale: 1:1; Разраб.: Иванов; Обозначение документа: АБВГ.123456.001 Э3; Пров.: Петров; Утв.: Сидоров; Наименование организации: ОАО "Концерн "МПО-Гидроприбор"; Перв. применение: АБВГ.123456.000; Наименование изделия 1: Плата; Наименование изделия 2: Схема электрическая; Наименование изделия 3: принципиальная; Нач. отд.: Нач. отд.; Фамилия нач. отд.: Сидоров
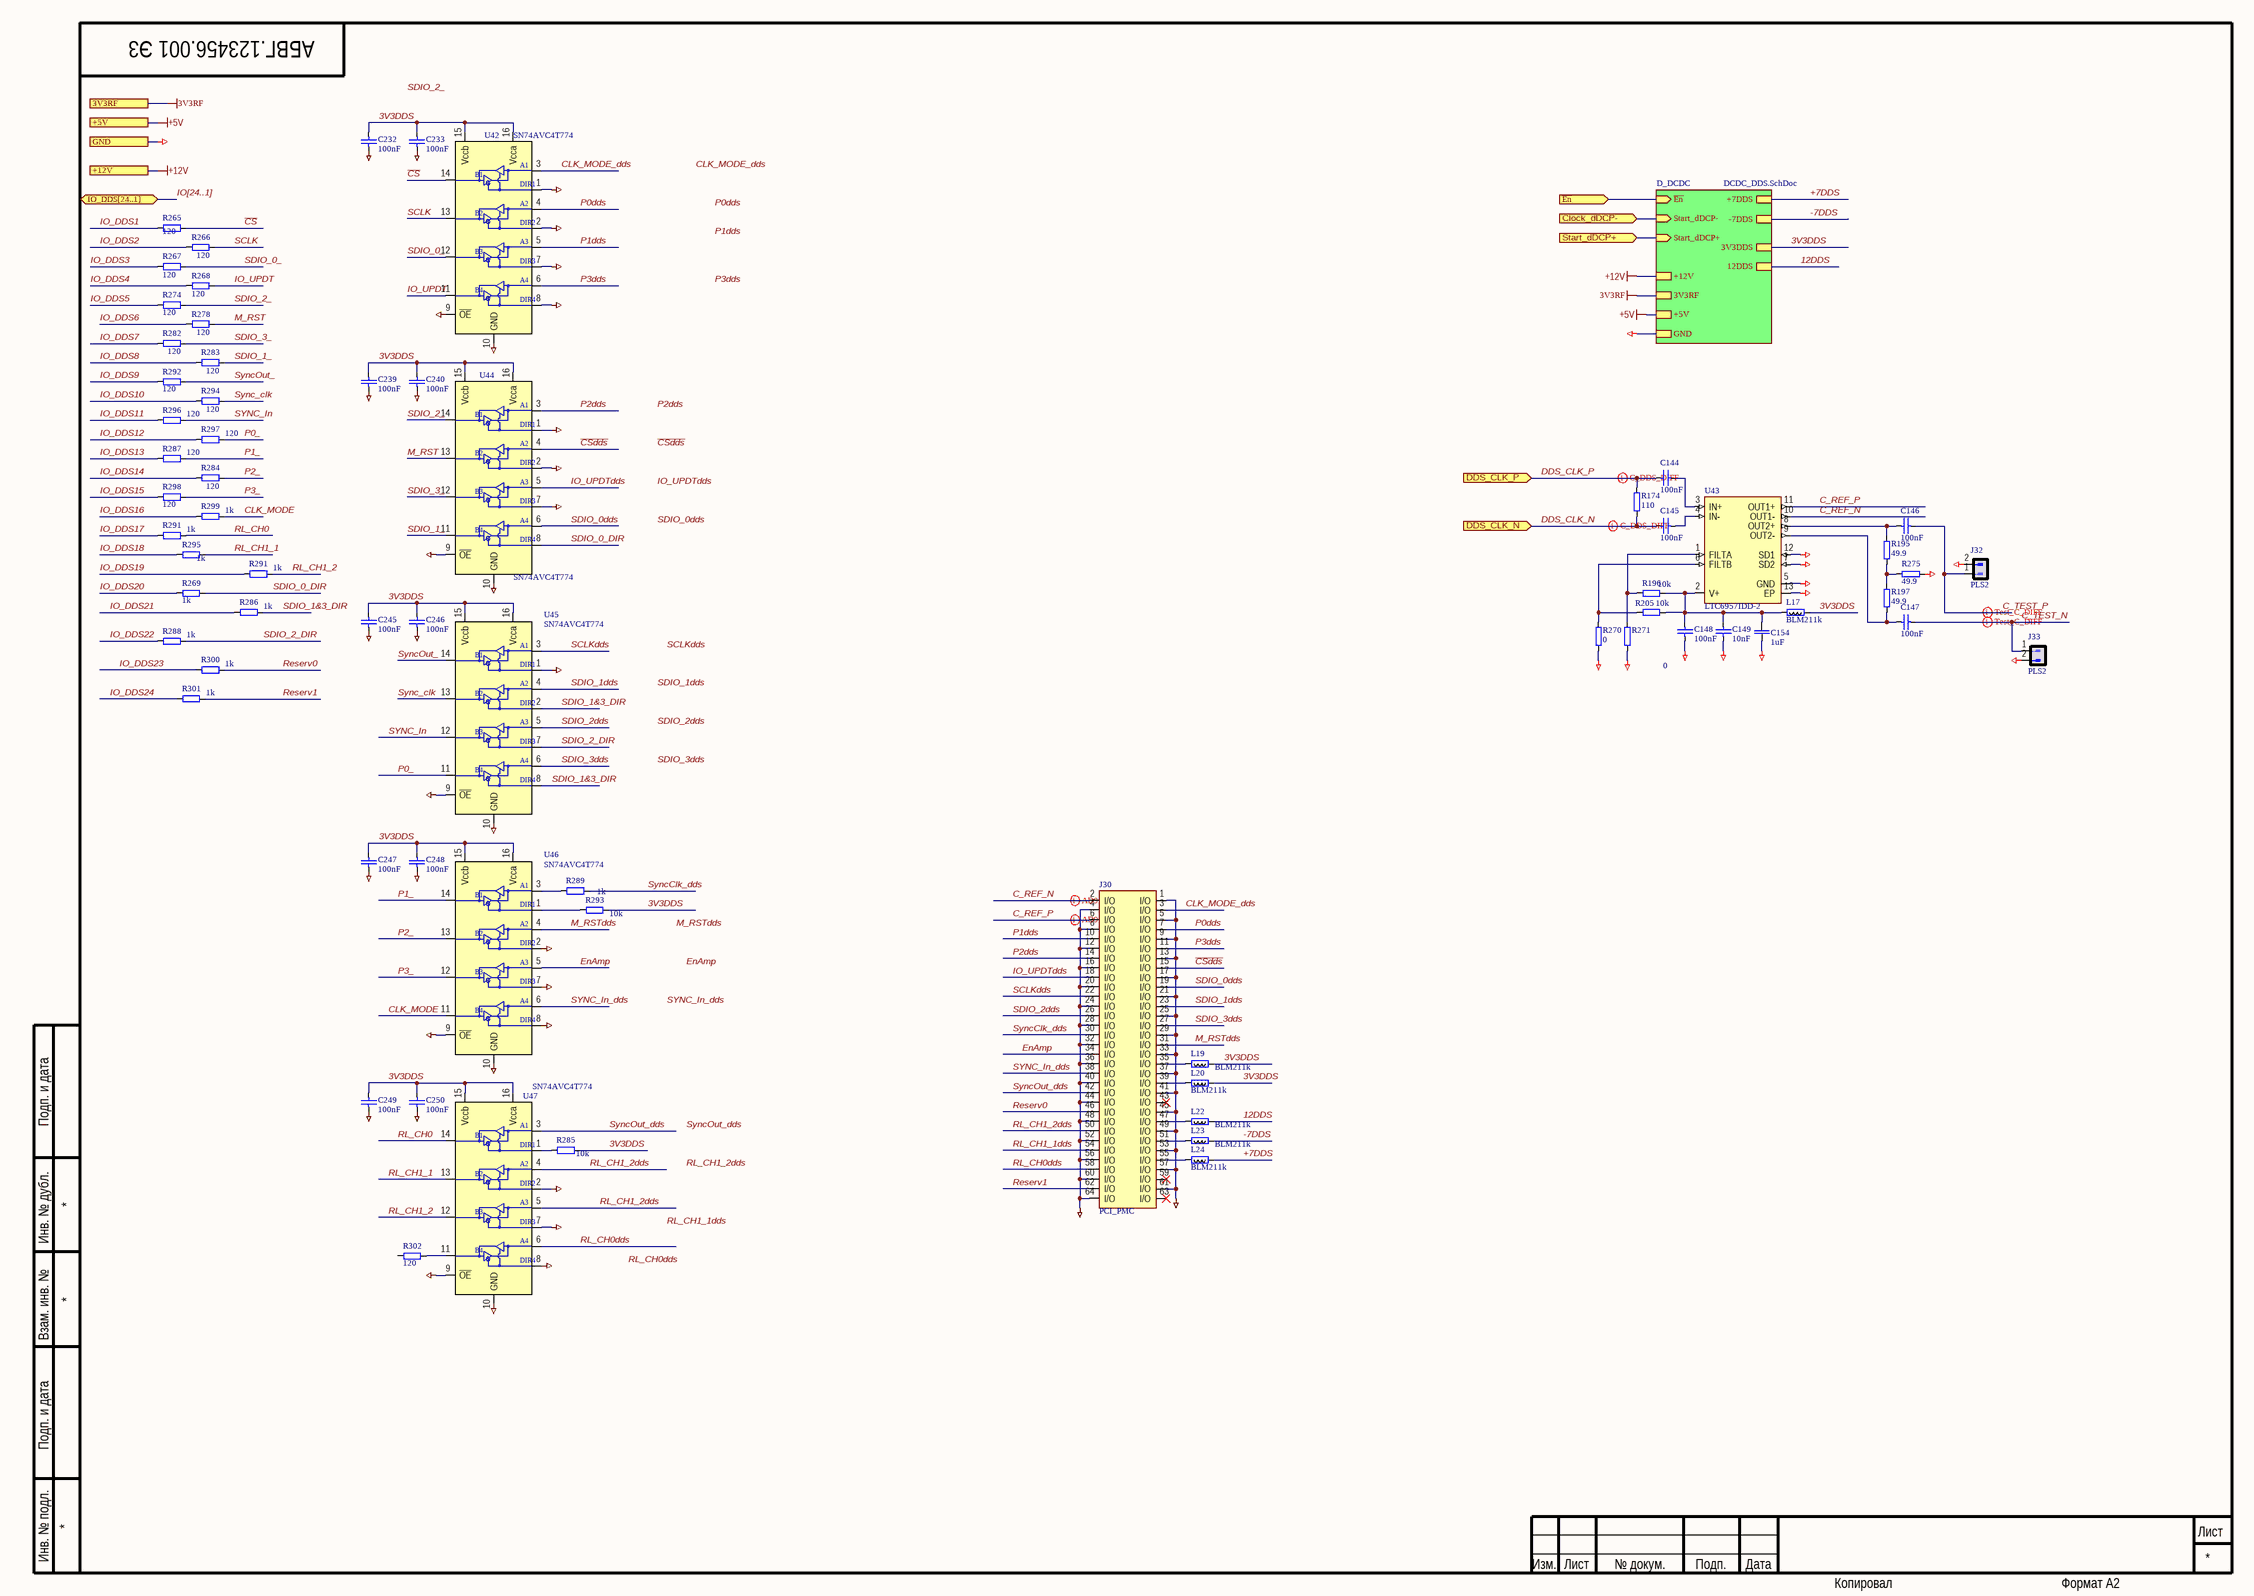
[diagram p19: DDS.SchDoc]

### Parts
(Parts that share a designator on the sheet are numbered #1, #2 ... from top to bottom, then left to right.)
C144  100nF  [CAPC1608X87N]
C145  100nF  [CAPC1608X87N]
C146  100nF  [CAPC1608X87N]
C147  100nF  [CAPC1608X87N]
C148  100nF  [CAPC1608X87N]
C149  10nF  [CAPC1608X87N]
C154  1uF  [0508]
C232  100nF  [SMD0805CAP]
C233  100nF  [SMD0805CAP]
C239  100nF  [SMD0805CAP]
C240  100nF  [SMD0805CAP]
C245  100nF  [SMD0805CAP]
C246  100nF  [SMD0805CAP]
C247  100nF  [SMD0805CAP]
C248  100nF  [SMD0805CAP]
C249  100nF  [SMD0805CAP]
C250  100nF  [SMD0805CAP]
J30  PCI_PMC  [TYCO_120521-1]
J32  PLS2  [PLS2]
J33  PLS2  [PLS2]
L17  BLM211k  [RESC2012X50N]
L19  BLM211k  [RESC2012X50N]
L20  BLM211k  [RESC2012X50N]
L22  BLM211k  [RESC2012X50N]
L23  BLM211k  [RESC2012X50N]
L24  BLM211k  [RESC2012X50N]
R174  110  [RESC1608X64N]
R195  49.9  [RESC1608X64N]
R196  10k  [RESC1608X64N]
R197  49.9  [RESC1608X64N]
R205  10k  [RESC1608X64N]
R265  120  [SMD0805RES]
R266  120  [SMD0805RES]
R267  120  [SMD0805RES]
R268  120  [SMD0805RES]
R269  1k  [SMD0805RES]
R270  0  [RESC1608X64N]
R271  0  [RESC1608X64N]
R274  120  [SMD0805RES]
R275  49.9  [SMD0805RES]
R278  120  [SMD0805RES]
R282  120  [SMD0805RES]
R283  120  [SMD0805RES]
R284  120  [SMD0805RES]
R285  10k  [SMD0805RES]
R286  1k  [SMD0805RES]
R287  120  [SMD0805RES]
R288  1k  [SMD0805RES]
R289  1k  [SMD0805RES]
R291#1  1k  [SMD0805RES]
R291#2  1k  [SMD0805RES]
R292  120  [SMD0805RES]
R293  10k  [SMD0805RES]
R294  120  [SMD0805RES]
R295  1k  [SMD0805RES]
R296  120  [SMD0805RES]
R297  120  [SMD0805RES]
R298  120  [SMD0805RES]
R299  1k  [SMD0805RES]
R300  1k  [SMD0805RES]
R301  1k  [SMD0805RES]
R302  120  [SMD0805RES]
U42  SN74AVC4T774  [TSSOP-16]
U43  LTC6957IDD-2  [DFN13-045]
U44  SN74AVC4T774  [TSSOP-16]
U45  SN74AVC4T774  [TSSOP-16]
U46  SN74AVC4T774  [TSSOP-16]
U47  SN74AVC4T774  [TSSOP-16]

### Sub-sheets
D_DCDC = DCDC_DDS.SchDoc: +7DDS, -7DDS, 3V3DDS, ~{En} (in), Start_dDCP- (in), Start_dDCP+ (in), +5V, GND, 3V3RF, +12V, 12DDS

### Ports
3V3RF, +5V, +12V, Clock_dDCP- (in), DDS_CLK_N (in), DDS_CLK_P (in), GND, IO_DDS[24..1] (bidir), Start_dDCP+ (in), ~{En} (in)

### Nets
3V3RF: port 3V3RF, sheet D_DCDC/3V3RF
+5V: port +5V, sheet D_DCDC/+5V
+12V: port +12V, sheet D_DCDC/+12V
GND: C148.1 C149.1 C154.2 C232.1 C233.1 C239.1 C240.1 C245.1 C246.1 C247.1 C248.1 C249.1 C250.1 J30.1(I/O) J30.4(I/O) J30.5(I/O) J30.8(I/O) J30.9(I/O) J30.12(I/O) J30.13(I/O) J30.16(I/O) J30.17(I/O) J30.20(I/O) J30.21(I/O) J30.24(I/O) J30.25(I/O) J30.28(I/O) J30.29(I/O) J30.32(I/O) J30.33(I/O) J30.36(I/O) J30.37(I/O) J30.40(I/O) J30.41(I/O) J30.44(I/O) J30.45(I/O) J30.48(I/O) J30.49(I/O) J30.52(I/O) J30.53(I/O) J30.56(I/O) J30.57(I/O) J30.60(I/O) J30.61(I/O) J30.64(I/O) J32.2 J33.2 R270.1 R271.1 R275.1 U42.1(DIR1) U42.2(DIR2) U42.7(DIR3) U42.8(DIR4) U42.9(~{OE}) U42.10(GND) U43.5(GND) U43.7(SD2) U43.12(SD1) U43.13(EP) U44.1(DIR1) U44.2(DIR2) U44.7(DIR3) U44.9(~{OE}) U44.10(GND) U45.1(DIR1) U45.9(~{OE}) U45.10(GND) U46.2(DIR2) U46.7(DIR3) U46.8(DIR4) U46.9(~{OE}) U46.10(GND) U47.2(DIR2) U47.7(DIR3) U47.8(DIR4) U47.9(~{OE}) U47.10(GND) ; port GND, sheet D_DCDC/GND
3V3DDS: C232.2 C233.2 C239.2 C240.2 C245.2 C246.2 C247.2 C248.2 C249.2 C250.2 L17.2 L19.2 L20.2 R285.1 R293.1 U42.15(Vccb) U42.16(Vcca) U44.15(Vccb) U44.16(Vcca) U45.15(Vccb) U45.16(Vcca) U46.15(Vccb) U46.16(Vcca) U47.15(Vccb) U47.16(Vcca) ; sheet D_DCDC/3V3DDS
12DDS: L22.2 ; sheet D_DCDC/12DDS
+7DDS: L24.2 ; sheet D_DCDC/+7DDS
-7DDS: L23.2 ; sheet D_DCDC/-7DDS
~{CS}: R265.1 U42.14(B1)
~{CSdds}: J30.15(I/O) U44.4(A2)
~{En}: port ~{En}, sheet D_DCDC/~{En}
C_REF_N: J30.2(I/O) U43.10(OUT1-)
C_REF_P: J30.6(I/O) U43.11(OUT1+)
C_TEST_N: C147.2 J33.1
C_TEST_P: C146.2 J32.1
CLK_MODE: R299.1 U46.11(B4)
CLK_MODE_dds: J30.3(I/O) U42.3(A1)
Clock_dDCP-: port Clock_dDCP-, sheet D_DCDC/Start_dDCP-
DDS_CLK_N: C145.1 R174.1 ; port DDS_CLK_N
DDS_CLK_P: C144.1 R174.2 ; port DDS_CLK_P
EnAmp: J30.34(I/O) U46.5(A3)
IO_DDS1: R265.2
IO_DDS2: R266.2
IO_DDS3: R267.2
IO_DDS4: R268.2
IO_DDS5: R274.2
IO_DDS6: R278.2
IO_DDS7: R282.2
IO_DDS8: R283.2
IO_DDS9: R292.2
IO_DDS10: R294.2
IO_DDS11: R296.2
IO_DDS12: R297.2
IO_DDS13: R287.2
IO_DDS14: R284.2
IO_DDS15: R298.2
IO_DDS16: R299.2
IO_DDS17: R291#1.2
IO_DDS18: R295.2
IO_DDS19: R291#2.2
IO_DDS20: R269.1
IO_DDS21: R286.2
IO_DDS22: R288.2
IO_DDS23: R300.2
IO_DDS24: R301.2
IO_UPDT: R268.1 U42.11(B4)
IO_UPDTdds: J30.18(I/O) U44.5(A3)
M_RST: R278.1 U44.13(B2)
M_RSTdds: J30.31(I/O) U46.4(A2)
P0_: R297.1 U45.11(B4)
P0dds: J30.7(I/O) U42.4(A2)
P1_: R287.1 U46.14(B1)
P1dds: J30.10(I/O) U42.5(A3)
P2_: R284.1 U46.13(B2)
P2dds: J30.14(I/O) U44.3(A1)
P3_: R298.1 U46.12(B3)
P3dds: J30.11(I/O) U42.6(A4)
Reserv0: J30.46(I/O) R300.1
Reserv1: J30.62(I/O) R301.1
RL_CH0: R291#1.1 U47.14(B1)
RL_CH0dds: J30.58(I/O) U47.6(A4)
RL_CH1_1: R295.1 U47.13(B2)
RL_CH1_1dds: J30.54(I/O)
RL_CH1_2: R291#2.1 U47.12(B3)
RL_CH1_2dds: J30.50(I/O) U47.4(A2) U47.5(A3)
SCLK: R266.1 U42.13(B2)
SCLKdds: J30.22(I/O) U45.3(A1)
SDIO_0_: R267.1 U42.12(B3)
SDIO_0_DIR: R269.2 U44.8(DIR4)
SDIO_0dds: J30.19(I/O) U44.6(A4)
SDIO_1&3_DIR: R286.1 U45.2(DIR2) U45.8(DIR4)
SDIO_1_: R283.1 U44.11(B4)
SDIO_1dds: J30.23(I/O) U45.4(A2)
SDIO_2_: R274.1 U44.14(B1)
SDIO_2_DIR: R288.1 U45.7(DIR3)
SDIO_2dds: J30.26(I/O) U45.5(A3)
SDIO_3_: R282.1 U44.12(B3)
SDIO_3dds: J30.27(I/O) U45.6(A4)
Sync_clk: R294.1 U45.13(B2)
SYNC_In: R296.1 U45.12(B3)
SYNC_In_dds: J30.38(I/O) U46.6(A4)
SyncClk_dds: J30.30(I/O) R289.1
SyncOut_: R292.1 U45.14(B1)
SyncOut_dds: J30.42(I/O) U47.3(A1)
NetC144_2: C144.2 U43.3(IN+)
NetC145_2: C145.2 U43.4(IN-)
NetC146_1: C146.1 R195.2 U43.8(OUT2+)
NetC147_1: C147.1 R197.1 U43.9(OUT2-)
NetC148_2: C148.2 C149.2 C154.1 L17.1 R196.2 R205.2 U43.2(V+)
NetJ30_35: J30.35(I/O) L19.1
NetJ30_39: J30.39(I/O) L20.1
NetJ30_47: J30.47(I/O) L22.1
NetJ30_51: J30.51(I/O) L23.1
NetJ30_55: J30.55(I/O) L24.1
NetR195_1: R195.1 R197.2 R275.2
NetR196_1: R196.1 R271.2 U43.1(FILTA)
NetR205_1: R205.1 R270.2 U43.6(FILTB)
NetR285_2: R285.2 U47.1(DIR1)
NetR289_2: R289.2 U46.3(A1)
NetR293_2: R293.2 U46.1(DIR1)
NetR302_1: R302.1 U47.11(B4)
(unnamed): port Start_dDCP+, sheet D_DCDC/Start_dDCP+

Not connected (* = marked no-connect by the designer): J30 43(I/O)* 59(I/O)* 63(I/O)*; R302 2

### Buses and harness runs
bus IO[24..1] = port IO_DDS[24..1]

### Layout directives
differential pair: C_REF_N, C_REF_P, C_TEST_N, C_TEST_P
differential pair; rule Differential Pairs Routing [Pref Gap = 0.175mm    Min Gap  = 0.075mm    Max Gap  = 0.5mmPref Width = 0.25mm    Min Width  = 0.075mm    Max Width  = 0.5mm]: DDS_CLK_N, DDS_CLK_P

### Notes on the sheet
- Labels drawn without touching a wire or pin: CLK_MODE_dds, EnAmp, IO_UPDTdds, M_RSTdds, P0dds, P1dds, P2dds, P3dds, RL_CH0dds, RL_CH1_1dds, RL_CH1_2dds, SCLKdds, SDIO_0dds, SDIO_1dds, SDIO_2_, SDIO_2dds, SDIO_3dds, SYNC_In_dds, SyncOut_dds, ~{CSdds}
- Подп. и дата
- Инв. № дубл.
- Взам. инв. №
- Инв. № подл.
- Изм.
- Лист
- № докум.
- Подп.
- Дата
- Копировал
- Формат А2

### Library data of the parts
C144-C149 = C0603: Чип конденсатор 0603; Voltage: 50V; Vendor: Vishay; DielectricType: X5R; SMD Solders: 2; Solder Option: RM; Tolerance: 20%; Pkg: SMD0603; Device: Cap603; Price: 2
  C144-C148: Value: 100nF
  C149: Value: 10nF
C154 = CAP_LLL219R71A105: 1uF; 10V; 0805R; X7R; Low ESL; Reverse geometry; Vendor: muRata; SolderOption: 2; THD Solders: 0; PartField: LLL219R71A105; Pkg: 0508; Value: 1uF; SMD Solders: 2; ClassName: Soldered_BINP
C232 C233 C239 C240 C245-C250 = C0805: as C206 on sheet DCP_DC_DC; Value: 100nF; Price: 2
J30 = PCI_PMC_M: as J34 on sheet Integrator; Value: PCI_PMC; Vendor: TE Connectivity
J32 J33 = PLS2: as J38 on sheet Integrator; Price: 1; Device: PLS2
L17 L19 L20 L22-L24 = BLM21: as L35 on sheet Integrator; Price: 10; Device: BLM21
R174 R195-R197 R205 R270 R271 = R0603: Чип резистор 0603; Vendor: Vishay; SMD Solders: 2; Solder Option: RM; TC: 100ppm/C; Tolerance: 1%; Pkg: SMD0603; Pwr: 60mW; Device: Res603; Price: 2
  R174: Value: 110
  R195 R197: Value: 49.9
  R196 R205: Value: 10k
  R270 R271: Value: 0
R265-R268 R274 R278 R282-R289 R291#1 R291#2 R292-R302 = R0805: as R340 on sheet Integrator; Price: 2
  R265-R268 R274 R278 R282-R284 R287 R292 R294 R296-R298 R302: Value: 120
  R285 R293: Value: 10k
  R286 R288 R289 R291#1 R291#2 R295 R299-R301: Value: 1k
R269 R275 = R0805: as R233 on sheet DCP_DC_DC; Price: 2
  R269: Value: 1k
  R275: Value: 49.9
U42 U44-U47 = SN74AVC4T774: Двунаправленный буфер; Pkg: TSSOP16; SMD Solders: 16; Solder Option: RM; THD Solders: 0; Vendor: Texas Instruments; Voltage: 1V1.. 3.6V  I/Os are 4.6-V Tolerant; Name to order: SN74AVC4T774PW; Device: SN74AVC4T774; Price: 300
U43 = LTC6957-2: Bufer CMOS in to 2xLVDS out; Vendor: Analog Devices; Pkg: DFN045-13; SMD Solders: 13; Solder Option: outSrc; THD Solders: 0; Current: 72; Voltage: 2.15.. 3.45; Price: 4200; Device: LTC6957IDD-2; Name to order: LTC6957IDD-2

## Sheet DCDC_DDS.SchDoc
size 420 x 297 mm; Address1: Address1; Address2: Address2; Address3: Address3; Address4: Address4; SheetNumber: 1; Scale: 1:1; Разраб.: Иванов; Обозначение документа: АБВГ.123456.001 Э3; Пров.: Петров; Утв.: Сидоров; Наименование организации: ОАО "Концерн "МПО-Гидроприбор"; Перв. применение: АБВГ.123456.000; Наименование изделия 1: Плата; Наименование изделия 2: Схема электрическая; Наименование изделия 3: принципиальная; Нач. отд.: Нач. отд.; Фамилия нач. отд.: Сидоров
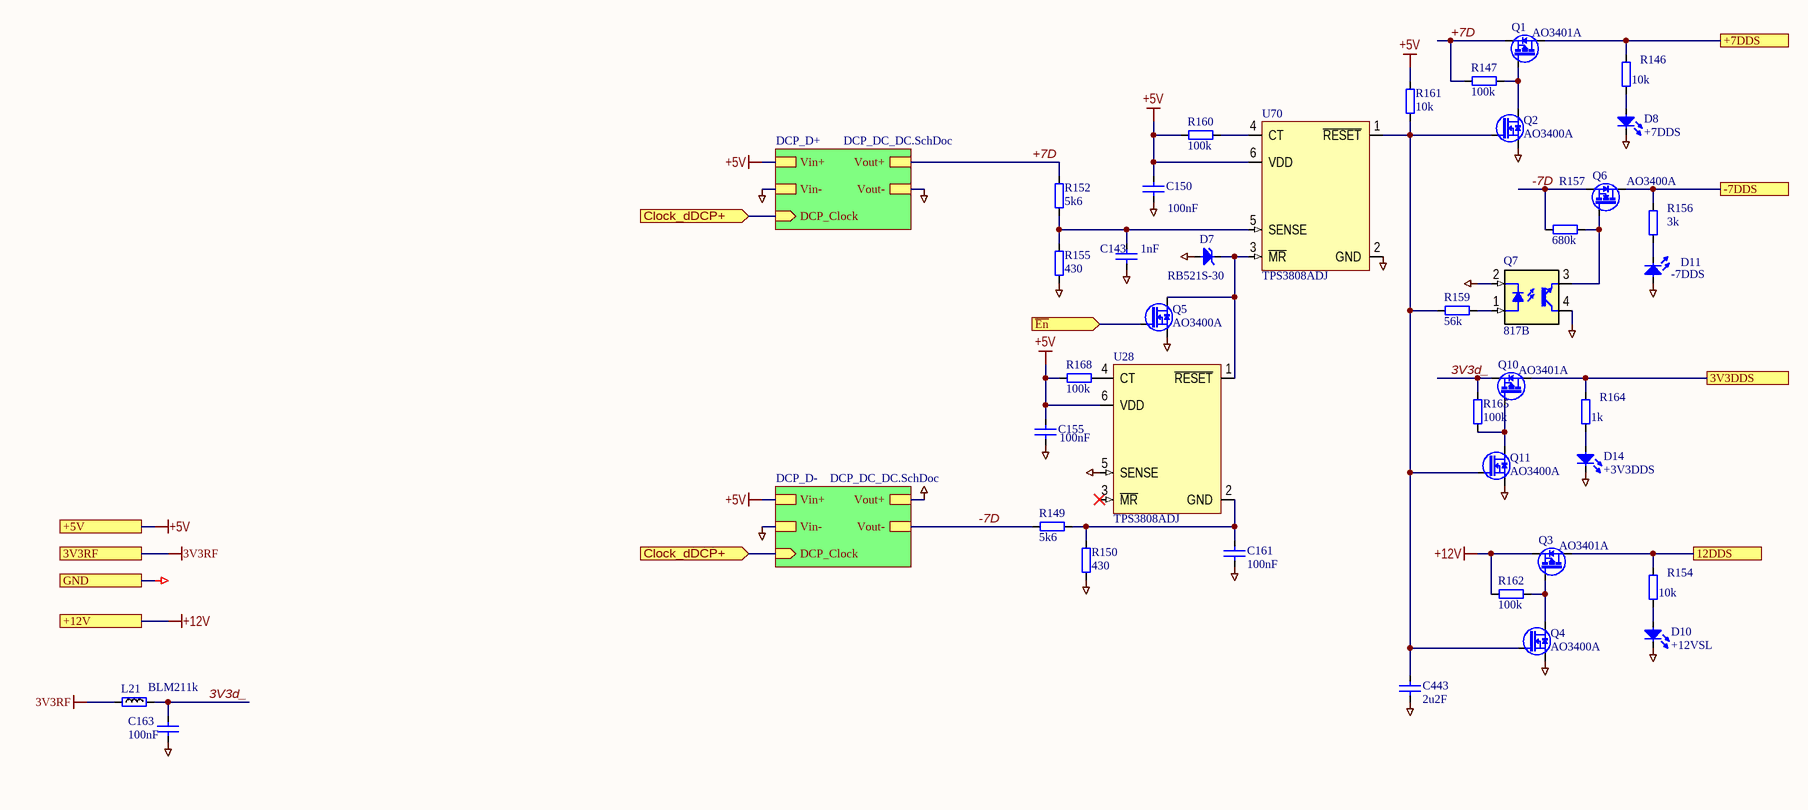
[diagram p20: DCDC_DDS.SchDoc]

### Parts
C143  1nF  [SMD0805CAP]
C150  100nF  [SMD0805CAP]
C155  100nF  [SMD0805CAP]
C161  100nF  [SMD0805CAP]
C163  100nF  [SMD0805CAP]
C443  2u2F  [SMD0805CAP]
D7  RB521S-30  [SODFL1608X65N]
D8  +7DDS  [LED0603]
D10  +12VSL  [LED0603]
D11  -7DDS  [LED0603]
D14  +3V3DDS  [LED0603]
L21  BLM211k  [RESC2012X50N]
Q1  AO3401A  [SOT95P229X119-3N]
Q2  AO3400A  [SOT95P229X119-3N]
Q3  AO3401A  [SOT95P229X119-3N]
Q4  AO3400A  [SOT95P229X119-3N]
Q5  AO3400A  [SOT95P229X119-3N]
Q6  AO3400A  [SOT95P229X119-3N]
Q7  817B  [DIP4-300]
Q10  AO3401A  [SOT95P229X119-3N]
Q11  AO3400A  [SOT95P229X119-3N]
R146  10k  [SMD0805RES]
R147  100k  [SMD0805RES]
R149  5k6  [SMD0805RES]
R150  430  [SMD0805RES]
R152  5k6  [SMD0805RES]
R154  10k  [SMD0805RES]
R155  430  [SMD0805RES]
R156  3k  [SMD0805RES]
R157  680k  [SMD0805RES]
R159  56k  [SMD0805RES]
R160  100k  [SMD0805RES]
R161  10k  [SMD0805RES]
R162  100k  [SMD0805RES]
R164  1k  [SMD0805RES]
R165  100k  [SMD0805RES]
R168  100k  [SMD0805RES]
U28  TPS3808ADJ  [SOT95P270X145-6N]
U70  TPS3808ADJ  [SOT95P270X145-6N]

### Sub-sheets
DCP_D+ = DCP_DC_DC.SchDoc: DCP_Clock (in), Vout+, Vout-, Vin-, Vin+
DCP_D- = DCP_DC_DC.SchDoc: DCP_Clock (in), Vout+, Vout-, Vin-, Vin+

### Ports
3V3DDS, 3V3RF, 12DDS, +5V, +7DDS, +12V, -7DDS, Clock_dDCP+ (in), GND, ~{En} (in)

### Nets
3V3RF: L21.2 ; port 3V3RF
+5V: C150.2 C155.2 R160.1 R161.1 R168.1 U28.6(VDD) U70.6(VDD) ; port +5V, sheet DCP_D+/Vin+, sheet DCP_D-/Vin+
+12V: Q3.2(S) R162.2 ; port +12V
GND: C143.1 C150.1 C155.1 C161.2 C163.1 C443.2 D7.2(A) D8.1(C) D10.1(C) D11.2(A) D14.1(C) Q2.2(S) Q4.2(S) Q5.2(S) Q7.2(C) Q7.4(C) Q11.2(S) R150.1 R155.1 U28.5(SENSE) U70.2(GND) ; port GND, sheet DCP_D+/Vout-, sheet DCP_D+/Vin-, sheet DCP_D-/Vout+, sheet DCP_D-/Vin-
3V3d_: C163.2 L21.1 Q10.2(S) R165.1
3V3DDS: Q10.3(D) R164.2 ; port 3V3DDS
12DDS: Q3.3(D) R154.2 ; port 12DDS
+7D: Q1.2(S) R147.2 R152.1 ; sheet DCP_D+/Vout+
+7DDS: Q1.3(D) R146.2 ; port +7DDS
-7D: Q6.2(S) R149.1 R157.2 ; sheet DCP_D-/Vout-
-7DDS: Q6.3(D) R156.2 ; port -7DDS
~{En}: Q5.1(G) ; port ~{En}
NetC143_2: C143.2 R152.2 R155.2 U70.5(SENSE)
NetC161_1: C161.1 R149.2 R150.2 U28.2(GND)
NetC443_1: C443.1 Q2.1(G) Q4.1(G) Q11.1(G) R159.1 R161.2 U70.1(~{RESET})
NetD7_1: D7.1(C) Q5.3(D) U28.1(~{RESET}) U70.3(~{MR})
NetD8_2: D8.2(A) R146.1
NetD10_2: D10.2(A) R154.1
NetD11_1: D11.1(C) R156.1
NetD14_2: D14.2(A) R164.1
NetQ1_1: Q1.1(G) Q2.3(D) R147.1
NetQ3_1: Q3.1(G) Q4.3(D) R162.1
NetQ6_1: Q6.1(G) Q7.3(E) R157.1
NetQ7_1: Q7.1(A) R159.2
NetQ10_1: Q10.1(G) Q11.3(D) R165.2
NetQ22_4_1: port Clock_dDCP+, sheet DCP_D+/DCP_Clock, sheet DCP_D-/DCP_Clock
NetR160_2: R160.2 U70.4(CT)
NetR168_2: R168.2 U28.4(CT)

Not connected (* = marked no-connect by the designer): U28 3(~{MR})*

### Notes on the sheet
- Подп. и дата
- Инв. № дубл.
- Взам. инв. №
- Инв. № подл.
- Изм.
- Лист
- № докум.
- Подп.
- Дата
- Копировал
- Формат А3

### Library data of the parts
C143 C150 C155 C161 C163 C443 = C0805: as C206 on sheet DCP_DC_DC; Price: 2
  C143: Value: 1nF
  C150 C155 C161 C163: Value: 100nF
  C443: Value: 2u2F
D7 = RB521S-30: as D9 on sheet DCDC_int; Price: 5; Device: RB521S-30; Name to order: RB521S-30
D8 D10 D11 D14 = LED0603: as D32 on sheet DCDC_int; Price: 10; Device: LED0603
  D8: Value: +7DDS
  D10: Value: +12VSL
  D11: Value: -7DDS
  D14: Value: +3V3DDS
L21 = BLM21: as L35 on sheet Integrator; Price: 10; Device: BLM21
Q1 Q3 Q10 = AO3401A: as Q29 on sheet DCDC_int; Price: 10; Device: AO3401A; Name to order: AO3401A
Q2 Q4-Q6 Q11 = AO3400A: as Q22 on sheet DCP_DC_DC; Price: 10; Device: AO3400A; Name to order: AO3400A
Q7 = 817B: as Q35 on sheet DCDC_int; Device: 817B; Price: 10; Name to order: 817B; Current: 0
R146 R147 R149 R150 R152 R154-R157 R159-R162 R164 R165 R168 = R0805: as R233 on sheet DCP_DC_DC; Price: 2
  R146 R154 R161: Value: 10k
  R147 R160 R162 R165 R168: Value: 100k
  R149 R152: Value: 5k6
  R150 R155: Value: 430
  R156: Value: 3k
  R157: Value: 680k
  R159: Value: 56k
  R164: Value: 1k
U28 U70 = TPS3808: as U37 on sheet DCDC_int; Price: 200; Device: TPS3808